# EAGLE schematic chess (EAGLE 6.1)
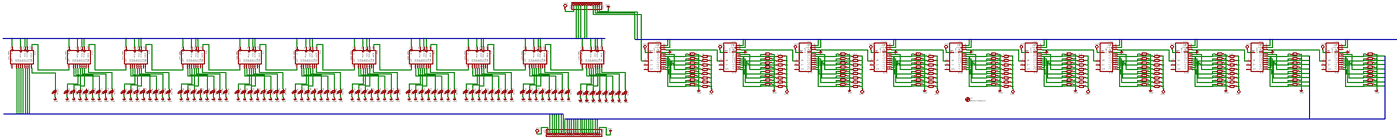
[diagram p0: schematic, sheet 1, overview]
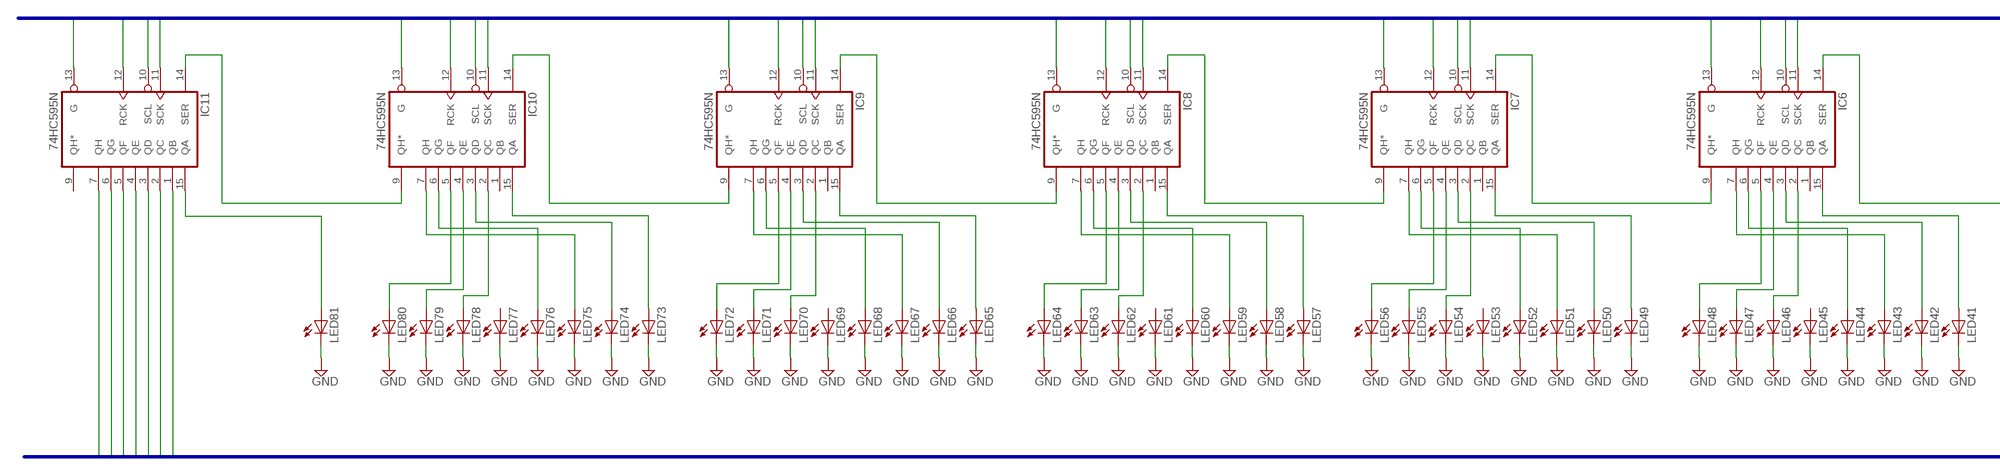
[diagram p1: schematic, sheet 1, part 1 of 4]
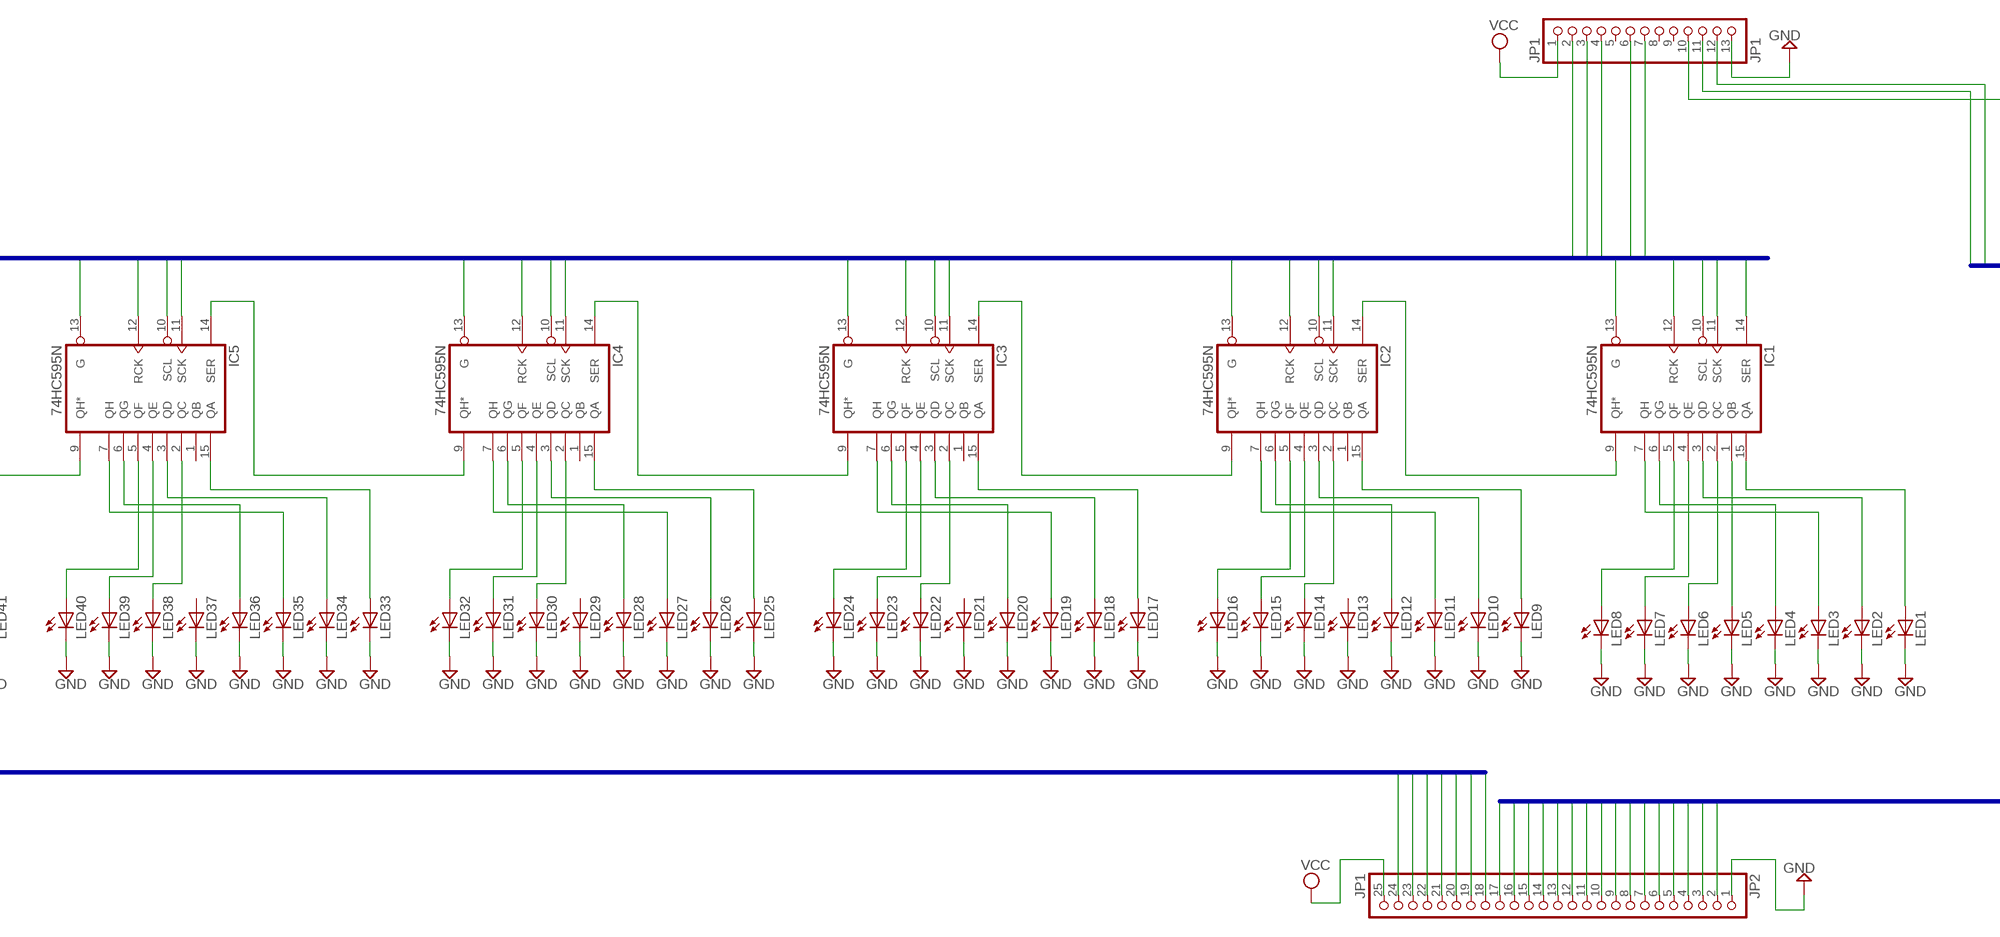
[diagram p2: schematic, sheet 1, part 2 of 4]
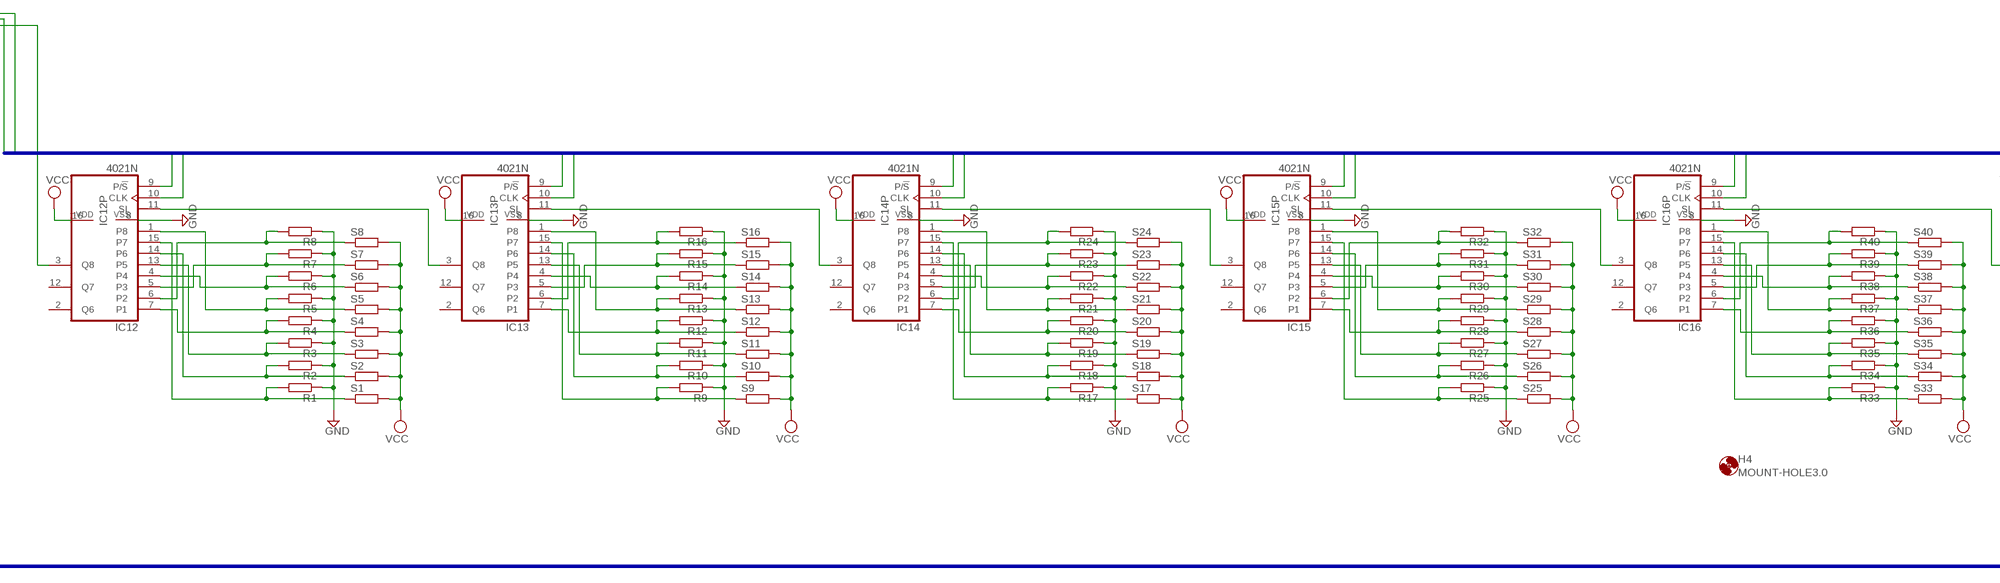
[diagram p3: schematic, sheet 1, part 3 of 4]
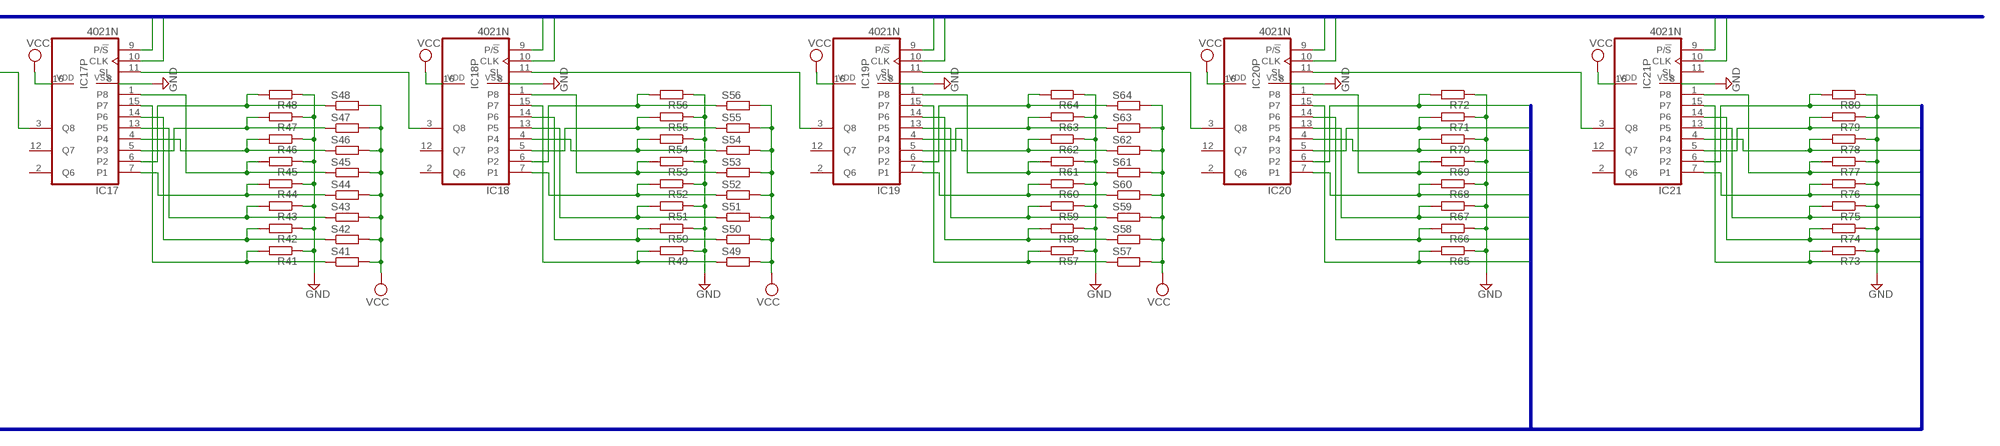
[diagram p4: schematic, sheet 1, part 4 of 4]

## Parts
H4  MOUNT-HOLE3.0  [3,0]
IC1  74HC595N  [DIL16]
IC2  74HC595N  [DIL16]
IC3  74HC595N  [DIL16]
IC4  74HC595N  [DIL16]
IC5  74HC595N  [DIL16]
IC6  74HC595N  [DIL16]
IC7  74HC595N  [DIL16]
IC8  74HC595N  [DIL16]
IC9  74HC595N  [DIL16]
IC10  74HC595N  [DIL16]
IC11  74HC595N  [DIL16]
IC12  4021N  [DIL16]
IC13  4021N  [DIL16]
IC14  4021N  [DIL16]
IC15  4021N  [DIL16]
IC16  4021N  [DIL16]
IC17  4021N  [DIL16]
IC18  4021N  [DIL16]
IC19  4021N  [DIL16]
IC20  4021N  [DIL16]
IC21  4021N  [DIL16]
JP1  JP1  PINHD-1X13  [1X13]
JP2  JP1  PINHD-1X25  [1X25]
LED1  LED5MM  [LED5MM]
LED2  LED5MM  [LED5MM]
LED3  LED5MM  [LED5MM]
LED4  LED5MM  [LED5MM]
LED5  LED5MM  [LED5MM]
LED6  LED5MM  [LED5MM]
LED7  LED5MM  [LED5MM]
LED8  LED5MM  [LED5MM]
LED9  LED5MM  [LED5MM]
LED10  LED5MM  [LED5MM]
LED11  LED5MM  [LED5MM]
LED12  LED5MM  [LED5MM]
LED13  LED5MM  [LED5MM]
LED14  LED5MM  [LED5MM]
LED15  LED5MM  [LED5MM]
LED16  LED5MM  [LED5MM]
LED17  LED5MM  [LED5MM]
LED18  LED5MM  [LED5MM]
LED19  LED5MM  [LED5MM]
LED20  LED5MM  [LED5MM]
LED21  LED5MM  [LED5MM]
LED22  LED5MM  [LED5MM]
LED23  LED5MM  [LED5MM]
LED24  LED5MM  [LED5MM]
LED25  LED5MM  [LED5MM]
LED26  LED5MM  [LED5MM]
LED27  LED5MM  [LED5MM]
LED28  LED5MM  [LED5MM]
LED29  LED5MM  [LED5MM]
LED30  LED5MM  [LED5MM]
LED31  LED5MM  [LED5MM]
LED32  LED5MM  [LED5MM]
LED33  LED5MM  [LED5MM]
LED34  LED5MM  [LED5MM]
LED35  LED5MM  [LED5MM]
LED36  LED5MM  [LED5MM]
LED37  LED5MM  [LED5MM]
LED38  LED5MM  [LED5MM]
LED39  LED5MM  [LED5MM]
LED40  LED5MM  [LED5MM]
LED41  LED5MM  [LED5MM]
LED42  LED5MM  [LED5MM]
LED43  LED5MM  [LED5MM]
LED44  LED5MM  [LED5MM]
LED45  LED5MM  [LED5MM]
LED46  LED5MM  [LED5MM]
LED47  LED5MM  [LED5MM]
LED48  LED5MM  [LED5MM]
LED49  LED5MM  [LED5MM]
LED50  LED5MM  [LED5MM]
LED51  LED5MM  [LED5MM]
LED52  LED5MM  [LED5MM]
LED53  LED5MM  [LED5MM]
LED54  LED5MM  [LED5MM]
LED55  LED5MM  [LED5MM]
LED56  LED5MM  [LED5MM]
LED57  LED5MM  [LED5MM]
LED58  LED5MM  [LED5MM]
LED59  LED5MM  [LED5MM]
LED60  LED5MM  [LED5MM]
LED61  LED5MM  [LED5MM]
LED62  LED5MM  [LED5MM]
LED63  LED5MM  [LED5MM]
LED64  LED5MM  [LED5MM]
LED65  LED5MM  [LED5MM]
LED66  LED5MM  [LED5MM]
LED67  LED5MM  [LED5MM]
LED68  LED5MM  [LED5MM]
LED69  LED5MM  [LED5MM]
LED70  LED5MM  [LED5MM]
LED71  LED5MM  [LED5MM]
LED72  LED5MM  [LED5MM]
LED73  LED5MM  [LED5MM]
LED74  LED5MM  [LED5MM]
LED75  LED5MM  [LED5MM]
LED76  LED5MM  [LED5MM]
LED77  LED5MM  [LED5MM]
LED78  LED5MM  [LED5MM]
LED79  LED5MM  [LED5MM]
LED80  LED5MM  [LED5MM]
LED81  LED5MM  [LED5MM]
R1  R-EU_0207/15  [0207/15]
R2  R-EU_0207/15  [0207/15]
R3  R-EU_0207/15  [0207/15]
R4  R-EU_0207/15  [0207/15]
R5  R-EU_0207/15  [0207/15]
R6  R-EU_0207/15  [0207/15]
R7  R-EU_0207/15  [0207/15]
R8  R-EU_0207/15  [0207/15]
R9  R-EU_0207/15  [0207/15]
R10  R-EU_0207/15  [0207/15]
R11  R-EU_0207/15  [0207/15]
R12  R-EU_0207/15  [0207/15]
R13  R-EU_0207/15  [0207/15]
R14  R-EU_0207/15  [0207/15]
R15  R-EU_0207/15  [0207/15]
R16  R-EU_0207/15  [0207/15]
R17  R-EU_0207/15  [0207/15]
R18  R-EU_0207/15  [0207/15]
R19  R-EU_0207/15  [0207/15]
R20  R-EU_0207/15  [0207/15]
R21  R-EU_0207/15  [0207/15]
R22  R-EU_0207/15  [0207/15]
R23  R-EU_0207/15  [0207/15]
R24  R-EU_0207/15  [0207/15]
R25  R-EU_0207/15  [0207/15]
R26  R-EU_0207/15  [0207/15]
R27  R-EU_0207/15  [0207/15]
R28  R-EU_0207/15  [0207/15]
R29  R-EU_0207/15  [0207/15]
R30  R-EU_0207/15  [0207/15]
R31  R-EU_0207/15  [0207/15]
R32  R-EU_0207/15  [0207/15]
R33  R-EU_0207/15  [0207/15]
R34  R-EU_0207/15  [0207/15]
R35  R-EU_0207/15  [0207/15]
R36  R-EU_0207/15  [0207/15]
R37  R-EU_0207/15  [0207/15]
R38  R-EU_0207/15  [0207/15]
R39  R-EU_0207/15  [0207/15]
R40  R-EU_0207/15  [0207/15]
R41  R-EU_0207/15  [0207/15]
R42  R-EU_0207/15  [0207/15]
R43  R-EU_0207/15  [0207/15]
R44  R-EU_0207/15  [0207/15]
R45  R-EU_0207/15  [0207/15]
R46  R-EU_0207/15  [0207/15]
R47  R-EU_0207/15  [0207/15]
R48  R-EU_0207/15  [0207/15]
R49  R-EU_0207/15  [0207/15]
R50  R-EU_0207/15  [0207/15]
R51  R-EU_0207/15  [0207/15]
R52  R-EU_0207/15  [0207/15]
R53  R-EU_0207/15  [0207/15]
R54  R-EU_0207/15  [0207/15]
R55  R-EU_0207/15  [0207/15]
R56  R-EU_0207/15  [0207/15]
R57  R-EU_0207/15  [0207/15]
R58  R-EU_0207/15  [0207/15]
R59  R-EU_0207/15  [0207/15]
R60  R-EU_0207/15  [0207/15]
R61  R-EU_0207/15  [0207/15]
R62  R-EU_0207/15  [0207/15]
R63  R-EU_0207/15  [0207/15]
R64  R-EU_0207/15  [0207/15]
R65  R-EU_0207/15  [0207/15]
R66  R-EU_0207/15  [0207/15]
R67  R-EU_0207/15  [0207/15]
R68  R-EU_0207/15  [0207/15]
R69  R-EU_0207/15  [0207/15]
R70  R-EU_0207/15  [0207/15]
R71  R-EU_0207/15  [0207/15]
R72  R-EU_0207/15  [0207/15]
R73  R-EU_0207/15  [0207/15]
R74  R-EU_0207/15  [0207/15]
R75  R-EU_0207/15  [0207/15]
R76  R-EU_0207/15  [0207/15]
R77  R-EU_0207/15  [0207/15]
R78  R-EU_0207/15  [0207/15]
R79  R-EU_0207/15  [0207/15]
R80  R-EU_0207/15  [0207/15]
S1  R-EU_0617/22  [0617/22]
S2  R-EU_0617/22  [0617/22]
S3  R-EU_0617/22  [0617/22]
S4  R-EU_0617/22  [0617/22]
S5  R-EU_0617/22  [0617/22]
S6  R-EU_0617/22  [0617/22]
S7  R-EU_0617/22  [0617/22]
S8  R-EU_0617/22  [0617/22]
S9  R-EU_0617/22  [0617/22]
S10  R-EU_0617/22  [0617/22]
S11  R-EU_0617/22  [0617/22]
S12  R-EU_0617/22  [0617/22]
S13  R-EU_0617/22  [0617/22]
S14  R-EU_0617/22  [0617/22]
S15  R-EU_0617/22  [0617/22]
S16  R-EU_0617/22  [0617/22]
S17  R-EU_0617/22  [0617/22]
S18  R-EU_0617/22  [0617/22]
S19  R-EU_0617/22  [0617/22]
S20  R-EU_0617/22  [0617/22]
S21  R-EU_0617/22  [0617/22]
S22  R-EU_0617/22  [0617/22]
S23  R-EU_0617/22  [0617/22]
S24  R-EU_0617/22  [0617/22]
S25  R-EU_0617/22  [0617/22]
S26  R-EU_0617/22  [0617/22]
S27  R-EU_0617/22  [0617/22]
S28  R-EU_0617/22  [0617/22]
S29  R-EU_0617/22  [0617/22]
S30  R-EU_0617/22  [0617/22]
S31  R-EU_0617/22  [0617/22]
S32  R-EU_0617/22  [0617/22]
S33  R-EU_0617/22  [0617/22]
S34  R-EU_0617/22  [0617/22]
S35  R-EU_0617/22  [0617/22]
S36  R-EU_0617/22  [0617/22]
S37  R-EU_0617/22  [0617/22]
S38  R-EU_0617/22  [0617/22]
S39  R-EU_0617/22  [0617/22]
S40  R-EU_0617/22  [0617/22]
S41  R-EU_0617/22  [0617/22]
S42  R-EU_0617/22  [0617/22]
S43  R-EU_0617/22  [0617/22]
S44  R-EU_0617/22  [0617/22]
S45  R-EU_0617/22  [0617/22]
S46  R-EU_0617/22  [0617/22]
S47  R-EU_0617/22  [0617/22]
S48  R-EU_0617/22  [0617/22]
S49  R-EU_0617/22  [0617/22]
S50  R-EU_0617/22  [0617/22]
S51  R-EU_0617/22  [0617/22]
S52  R-EU_0617/22  [0617/22]
S53  R-EU_0617/22  [0617/22]
S54  R-EU_0617/22  [0617/22]
S55  R-EU_0617/22  [0617/22]
S56  R-EU_0617/22  [0617/22]
S57  R-EU_0617/22  [0617/22]
S58  R-EU_0617/22  [0617/22]
S59  R-EU_0617/22  [0617/22]
S60  R-EU_0617/22  [0617/22]
S61  R-EU_0617/22  [0617/22]
S62  R-EU_0617/22  [0617/22]
S63  R-EU_0617/22  [0617/22]
S64  R-EU_0617/22  [0617/22]

## Nets
CLK: IC12.10(CLK) IC13.10(CLK) IC14.10(CLK) IC15.10(CLK) IC16.10(CLK) IC17.10(CLK) IC18.10(CLK) IC19.10(CLK) IC20.10(CLK) IC21.10(CLK) JP1.11
G: IC1.13(G) IC2.13(G) IC3.13(G) IC4.13(G) IC5.13(G) IC6.13(G) IC7.13(G) IC8.13(G) IC9.13(G) IC10.13(G) IC11.13(G) JP1.3
GND: IC12.8(VSS) IC13.8(VSS) IC14.8(VSS) IC15.8(VSS) IC16.8(VSS) IC17.8(VSS) IC18.8(VSS) IC19.8(VSS) IC20.8(VSS) IC21.8(VSS) JP1.13 JP2.1 LED1.K(C) LED2.K(C) LED3.K(C) LED4.K(C) LED5.K(C) LED6.K(C) LED7.K(C) LED8.K(C) LED9.K(C) LED10.K(C) LED11.K(C) LED12.K(C) LED13.K(C) LED14.K(C) LED15.K(C) LED16.K(C) LED17.K(C) LED18.K(C) LED19.K(C) LED20.K(C) LED21.K(C) LED22.K(C) LED23.K(C) LED24.K(C) LED25.K(C) LED26.K(C) LED27.K(C) LED28.K(C) LED29.K(C) LED30.K(C) LED31.K(C) LED32.K(C) LED33.K(C) LED34.K(C) LED35.K(C) LED36.K(C) LED37.K(C) LED38.K(C) LED39.K(C) LED40.K(C) LED41.K(C) LED42.K(C) LED43.K(C) LED44.K(C) LED45.K(C) LED46.K(C) LED47.K(C) LED48.K(C) LED49.K(C) LED50.K(C) LED51.K(C) LED52.K(C) LED53.K(C) LED54.K(C) LED55.K(C) LED56.K(C) LED57.K(C) LED58.K(C) LED59.K(C) LED60.K(C) LED61.K(C) LED62.K(C) LED63.K(C) LED64.K(C) LED65.K(C) LED66.K(C) LED67.K(C) LED68.K(C) LED69.K(C) LED70.K(C) LED71.K(C) LED72.K(C) LED73.K(C) LED74.K(C) LED75.K(C) LED76.K(C) LED77.K(C) LED78.K(C) LED79.K(C) LED80.K(C) LED81.K(C) R1.1 R2.1 R3.1 R4.1 R5.1 R6.1 R7.1 R8.1 R9.1 R10.1 R11.1 R12.1 R13.1 R14.1 R15.1 R16.1 R17.1 R18.1 R19.1 R20.1 R21.1 R22.1 R23.1 R24.1 R25.1 R26.1 R27.1 R28.1 R29.1 R30.1 R31.1 R32.1 R33.1 R34.1 R35.1 R36.1 R37.1 R38.1 R39.1 R40.1 R41.1 R42.1 R43.1 R44.1 R45.1 R46.1 R47.1 R48.1 R49.1 R50.1 R51.1 R52.1 R53.1 R54.1 R55.1 R56.1 R57.1 R58.1 R59.1 R60.1 R61.1 R62.1 R63.1 R64.1 R65.1 R66.1 R67.1 R68.1 R69.1 R70.1 R71.1 R72.1 R73.1 R74.1 R75.1 R76.1 R77.1 R78.1 R79.1 R80.1
N$1: IC1.9(QH*) IC2.14(SER)
N$2: IC2.15(QA) LED9.A
N$3: IC1.15(QA) LED1.A
N$4: IC1.1(QB) LED5.A
N$5: IC1.2(QC) LED6.A
N$6: IC1.3(QD) LED2.A
N$7: IC1.4(QE) LED7.A
N$8: IC1.5(QF) LED8.A
N$9: IC1.6(QG) LED4.A
N$10: IC1.7(QH) LED3.A
N$11: IC2.2(QC) LED14.A
N$12: IC2.3(QD) LED10.A
N$13: IC2.4(QE) LED15.A
N$14: IC2.5(QF) LED16.A
N$15: IC2.6(QG) LED12.A
N$16: IC2.7(QH) LED11.A
N$17: IC3.15(QA) LED17.A
N$18: IC3.2(QC) LED22.A
N$19: IC3.3(QD) LED18.A
N$20: IC3.4(QE) LED23.A
N$21: IC3.5(QF) LED24.A
N$22: IC3.6(QG) LED20.A
N$23: IC3.7(QH) LED19.A
N$24: IC4.15(QA) LED25.A
N$25: IC4.2(QC) LED30.A
N$26: IC4.3(QD) LED26.A
N$27: IC4.4(QE) LED31.A
N$28: IC2.9(QH*) IC3.14(SER)
N$29: IC4.5(QF) LED32.A
N$30: IC4.6(QG) LED28.A
N$31: IC4.7(QH) LED27.A
N$32: IC5.15(QA) LED33.A
N$33: IC5.2(QC) LED38.A
N$34: IC5.3(QD) LED34.A
N$35: IC5.4(QE) LED39.A
N$36: IC5.5(QF) LED40.A
N$37: IC5.6(QG) LED36.A
N$38: IC3.9(QH*) IC4.14(SER)
N$39: IC5.7(QH) LED35.A
N$40: IC6.15(QA) LED41.A
N$41: IC6.2(QC) LED46.A
N$42: IC6.3(QD) LED42.A
N$43: IC6.4(QE) LED47.A
N$44: IC6.5(QF) LED48.A
N$45: IC6.6(QG) LED44.A
N$46: IC6.7(QH) LED43.A
N$47: IC7.15(QA) LED49.A
N$48: IC4.9(QH*) IC5.14(SER)
N$49: IC7.2(QC) LED54.A
N$50: IC7.3(QD) LED50.A
N$51: IC7.4(QE) LED55.A
N$52: IC7.5(QF) LED56.A
N$53: IC7.6(QG) LED52.A
N$54: IC7.7(QH) LED51.A
N$55: IC8.15(QA) LED57.A
N$56: IC8.2(QC) LED62.A
N$57: IC8.3(QD) LED58.A
N$58: IC5.9(QH*) IC6.14(SER)
N$59: IC8.4(QE) LED63.A
N$60: IC8.5(QF) LED64.A
N$61: IC8.6(QG) LED60.A
N$62: IC8.7(QH) LED59.A
N$63: IC9.15(QA) LED65.A
N$64: IC9.2(QC) LED70.A
N$65: IC9.3(QD) LED66.A
N$66: IC9.4(QE) LED71.A
N$67: IC9.5(QF) LED72.A
N$68: IC6.9(QH*) IC7.14(SER)
N$69: IC9.6(QG) LED68.A
N$70: IC9.7(QH) LED67.A
N$71: IC10.15(QA) LED73.A
N$72: IC10.2(QC) LED78.A
N$73: IC10.3(QD) LED74.A
N$74: IC10.4(QE) LED79.A
N$75: IC10.5(QF) LED80.A
N$76: IC10.6(QG) LED76.A
N$77: IC10.7(QH) LED75.A
N$78: IC7.9(QH*) IC8.14(SER)
N$79: IC12.1(P8) R5.2 S5.1
N$80: IC8.9(QH*) IC9.14(SER)
N$81: IC13.6(P2) R16.2 S16.1
N$82: IC13.13(P5) R11.2 S11.1
N$83: IC13.7(P1) R12.2 S12.1
N$84: IC13.4 R14.2 S14.1
N$85: IC13.5(P3) R15.2 S15.1
N$86: IC13.14(P6) R10.2 S10.1
N$87: IC13.15(P7) R9.2 S9.1
N$88: IC13.1(P8) R13.2 S13.1
N$89: IC9.9(QH*) IC10.14(SER)
N$90: IC12.3(Q8) JP1.10
N$91: IC12.6(P2) R8.2 S8.1
N$92: IC14.6(P2) R24.2 S24.1
N$93: IC12.4 R6.2 S6.1
N$94: IC12.13(P5) R3.2 S3.1
N$95: IC12.7(P1) R4.2 S4.1
N$96: IC12.5(P3) R7.2 S7.1
N$97: IC11.15(QA) LED81.A
N$98: IC10.9(QH*) IC11.14(SER)
N$99: IC12.14(P6) R2.2 S2.1
N$100: IC12.15(P7) R1.2 S1.1
N$101: IC14.13(P5) R19.2 S19.1
N$102: IC14.7(P1) R20.2 S20.1
N$103: IC14.4 R22.2 S22.1
N$104: IC14.5(P3) R23.2 S23.1
N$105: IC14.14(P6) R18.2 S18.1
N$106: IC14.15(P7) R17.2 S17.1
N$107: IC14.1(P8) R21.2 S21.1
N$108: IC15.6(P2) R32.2 S32.1
N$109: IC15.13(P5) R27.2 S27.1
N$110: IC15.7(P1) R28.2 S28.1
N$111: IC12.11(SI) IC13.3(Q8)
N$112: IC15.4 R30.2 S30.1
N$113: IC15.5(P3) R31.2 S31.1
N$114: IC15.14(P6) R26.2 S26.1
N$115: IC15.15(P7) R25.2 S25.1
N$116: IC15.1(P8) R29.2 S29.1
N$117: IC16.6(P2) R40.2 S40.1
N$118: IC16.13(P5) R35.2 S35.1
N$119: IC16.7(P1) R36.2 S36.1
N$120: IC16.4 R38.2 S38.1
N$121: IC13.11(SI) IC14.3(Q8)
N$122: IC16.5(P3) R39.2 S39.1
N$123: IC16.14(P6) R34.2 S34.1
N$124: IC16.15(P7) R33.2 S33.1
N$125: IC16.1(P8) R37.2 S37.1
N$126: IC17.6(P2) R48.2 S48.1
N$127: IC17.13(P5) R43.2 S43.1
N$128: IC17.7(P1) R44.2 S44.1
N$129: IC17.4 R46.2 S46.1
N$130: IC17.5(P3) R47.2 S47.1
N$131: IC14.11(SI) IC15.3(Q8)
N$132: IC17.14(P6) R42.2 S42.1
N$133: IC17.15(P7) R41.2 S41.1
N$134: IC17.1(P8) R45.2 S45.1
N$135: IC18.6(P2) R56.2 S56.1
N$136: IC18.13(P5) R51.2 S51.1
N$137: IC18.7(P1) R52.2 S52.1
N$138: IC18.4 R54.2 S54.1
N$139: IC18.5(P3) R55.2 S55.1
N$140: IC18.14(P6) R50.2 S50.1
N$141: IC15.11(SI) IC16.3(Q8)
N$142: IC18.15(P7) R49.2 S49.1
N$143: IC18.1(P8) R53.2 S53.1
N$144: IC19.6(P2) R64.2 S64.1
N$145: IC19.13(P5) R59.2 S59.1
N$146: IC19.7(P1) R60.2 S60.1
N$147: IC19.4 R62.2 S62.1
N$148: IC19.5(P3) R63.2 S63.1
N$149: IC19.14(P6) R58.2 S58.1
N$150: IC19.15(P7) R57.2 S57.1
N$151: IC16.11(SI) IC17.3(Q8)
N$152: IC19.1(P8) R61.2 S61.1
N$153: IC19.11(SI) IC20.3(Q8)
N$155: IC20.11(SI) IC21.3(Q8)
N$161: IC17.11(SI) IC18.3(Q8)
N$171: IC18.11(SI) IC19.3(Q8)
PS: IC12.9(P/!S) IC13.9(P/!S) IC14.9(P/!S) IC15.9(P/!S) IC16.9(P/!S) IC17.9(P/!S) IC18.9(P/!S) IC19.9(P/!S) IC20.9(P/!S) IC21.9(P/!S) JP1.12
RCK: IC1.12(RCK) IC2.12(RCK) IC3.12(RCK) IC4.12(RCK) IC5.12(RCK) IC6.12(RCK) IC7.12(RCK) IC8.12(RCK) IC9.12(RCK) IC10.12(RCK) IC11.12(RCK) JP1.4
SCK: IC1.11(SCK) IC2.11(SCK) IC3.11(SCK) IC4.11(SCK) IC5.11(SCK) IC6.11(SCK) IC7.11(SCK) IC8.11(SCK) IC9.11(SCK) IC10.11(SCK) IC11.11(SCK) JP1.6
SCL: IC1.10(SCL) IC2.10(SCL) IC3.10(SCL) IC4.10(SCL) IC5.10(SCL) IC6.10(SCL) IC7.10(SCL) IC8.10(SCL) IC9.10(SCL) IC10.10(SCL) IC11.10(SCL) JP1.7
SER: IC1.14(SER) JP1.2
SIDELED1: IC11.1(QB) JP2.18
SIDELED2: IC11.2(QC) JP2.19
SIDELED3: IC11.3(QD) JP2.20
SIDELED4: IC11.4(QE) JP2.21
SIDELED5: IC11.5(QF) JP2.22
SIDELED6: IC11.6(QG) JP2.23
SIDELED7: IC11.7(QH) JP2.24
SIDESWITCH1: IC20.15(P7) JP2.2 R65.2
SIDESWITCH2: IC20.14(P6) JP2.3 R66.2
SIDESWITCH3: IC20.13(P5) JP2.4 R67.2
SIDESWITCH4: IC20.7(P1) JP2.5 R68.2
SIDESWITCH5: IC20.1(P8) JP2.6 R69.2
SIDESWITCH6: IC20.4 JP2.7 R70.2
SIDESWITCH7: IC20.5(P3) JP2.8 R71.2
SIDESWITCH8: IC20.6(P2) JP2.9 R72.2
SIDESWITCH9: IC21.15(P7) JP2.10 R73.2
SIDESWITCH10: IC21.14(P6) JP2.11 R74.2
SIDESWITCH11: IC21.13(P5) JP2.12 R75.2
SIDESWITCH12: IC21.7(P1) JP2.13 R76.2
SIDESWITCH13: IC21.1(P8) JP2.14 R77.2
SIDESWITCH14: IC21.4 JP2.15 R78.2
SIDESWITCH15: IC21.5(P3) JP2.16 R79.2
SIDESWITCH16: IC21.6(P2) JP2.17 R80.2
VCC: IC12.16(VDD) IC13.16(VDD) IC14.16(VDD) IC15.16(VDD) IC16.16(VDD) IC17.16(VDD) IC18.16(VDD) IC19.16(VDD) IC20.16(VDD) IC21.16(VDD) JP1.1 JP2.25 S1.2 S2.2 S3.2 S4.2 S5.2 S6.2 S7.2 S8.2 S9.2 S10.2 S11.2 S12.2 S13.2 S14.2 S15.2 S16.2 S17.2 S18.2 S19.2 S20.2 S21.2 S22.2 S23.2 S24.2 S25.2 S26.2 S27.2 S28.2 S29.2 S30.2 S31.2 S32.2 S33.2 S34.2 S35.2 S36.2 S37.2 S38.2 S39.2 S40.2 S41.2 S42.2 S43.2 S44.2 S45.2 S46.2 S47.2 S48.2 S49.2 S50.2 S51.2 S52.2 S53.2 S54.2 S55.2 S56.2 S57.2 S58.2 S59.2 S60.2 S61.2 S62.2 S63.2 S64.2
Unconnected: IC2.1(QB) IC3.1(QB) IC4.1(QB) IC5.1(QB) IC6.1(QB) IC7.1(QB) IC8.1(QB) IC9.1(QB) IC10.1(QB) IC11.9(QH*) IC12.2(Q6) IC12.12(Q7) IC13.2(Q6) IC13.12(Q7) IC14.2(Q6) IC14.12(Q7) IC15.2(Q6) IC15.12(Q7) IC16.2(Q6) IC16.12(Q7) IC17.2(Q6) IC17.12(Q7) IC18.2(Q6) IC18.12(Q7) IC19.2(Q6) IC19.12(Q7) IC20.2(Q6) IC20.12(Q7) IC21.2(Q6) IC21.11(SI) IC21.12(Q7) JP1.5 JP1.8 JP1.9 LED13.A LED21.A LED29.A LED37.A LED45.A LED53.A LED61.A LED69.A LED77.A

## Buses
G,RCK,SCL,SCK,SER
PS,CLK
SIDELED[1..7]
SIDESWITCH[1..16]

## Power pins joined to a net without a drawn wire
GND: IC1.8(GND) IC2.8(GND) IC3.8(GND) IC4.8(GND) IC5.8(GND) IC6.8(GND) IC7.8(GND) IC8.8(GND) IC9.8(GND) IC10.8(GND) IC11.8(GND)
VCC: IC1.16(VCC) IC2.16(VCC) IC3.16(VCC) IC4.16(VCC) IC5.16(VCC) IC6.16(VCC) IC7.16(VCC) IC8.16(VCC) IC9.16(VCC) IC10.16(VCC) IC11.16(VCC)

## Library data of the parts
H4 = holes:MOUNT-HOLE: MOUNTING HOLE with drill center marker
IC1-IC11 = 74xx-eu:74*595: 8-bit SHIFT REGISTER, output latch
IC12-IC21 = 40xx:4021: 8-bit static SHIFT REGISTER
JP1 = pinhead:PINHD-1X13: PIN HEADER
JP2 = pinhead:PINHD-1X25: PIN HEADER
LED1-LED81 = led:LED: LED OSRAM: - CHIPLED LG R971, LG N971, LY N971, LG Q971, LY Q971, LO R971, LY R971 LH N974, LH R974 LS Q976, LO Q976, LY Q976 LO Q996 - Hyper CHIPLED LW Q18S LB Q993, LB Q99A, LB R99A - SideLED LS A670, LO A670, LY A670, LG A670, LP A670 LB A673, LV A673, LT A673, LW A673 LH A674 LY A675 LS A676, LA A676, LO A676, LY A676, LW A676 LS A679, LY A679, LG A679 - Hyper Micro SIDELED® LS Y876, LA Y876, LO Y876, LY Y876 LT Y87S - SmartLED LW L88C, LW L88S LB L89C, LB L89S, LG L890 LS L89K, LO L89K, LY L89K LS L896, LA L896, LO L896, LY L896 - TOPLED LS T670, LO T670, LY T670, LG T670, LP T670 LSG T670, LSP T670, LSY T670, LOP T670, LYG T670 LG T671, LOG T671, LSG T671 LB T673, LV T673, LT T673, LW T673 LH T674 LS T676, LA T676, LO T676, LY T676, LB T676, LH T676, LSB T676, LW T676 LB T67C, LV T67C, LT T67C, LS T67K, LO T67K, LY T67K, LW E67C LS E67B, LA E67B, LO E67B, LY E67B, LB E67C, LV E67C, LT E67C LW T67C LS T679, LY T679, LG T679 LS T770, LO T770, LY T770, LG T770, LP T770 LB T773, LV T773, LT T773, LW T773 LH T774 LS E675, LA E675, LY E675, LS T675 LS T776, LA T776, LO T776, LY T776, LB T776 LHGB T686 LT T68C, LB T68C - Hyper Mini TOPLED® LB M676 - Mini TOPLED Santana® LG M470 LS M47K, LO M47K, LY M47K Source: http://www.osram.convergy.de LUXEON: - LUMILED® LXK2-PW12-R00, LXK2-PW12-S00, LXK2-PW14-U00, LXK2-PW14-V00 LXK2-PM12-R00, LXK2-PM12-S00, LXK2-PM14-U00 LXK2-PE12-Q00, LXK2-PE12-R00, LXK2-PE12-S00, LXK2-PE14-T00, LXK2-PE14-U00 LXK2-PB12-K00, LXK2-PB12-L00, LXK2-PB12-M00, LXK2-PB14-N00, LXK2-PB14-P00, LXK2-PB14-Q00 LXK2-PR12-L00, LXK2-PR12-M00, LXK2-PR14-Q00, LXK2-PR14-R00 LXK2-PD12-Q00, LXK2-PD12-R00, LXK2-PD12-S00 LXK2-PH12-R00, LXK2-PH12-S00 LXK2-PL12-P00, LXK2-PL12-Q00, LXK2-PL12-R00 Source: www.luxeon.com KINGBRIGHT: KA-3528ASYC Source: www.kingbright.com
R1-R80 S1-S64 = rcl:R-EU_: RESISTOR, European symbol

## Net classes
0 default: width 0.356 mm, clearance 1.219 mm